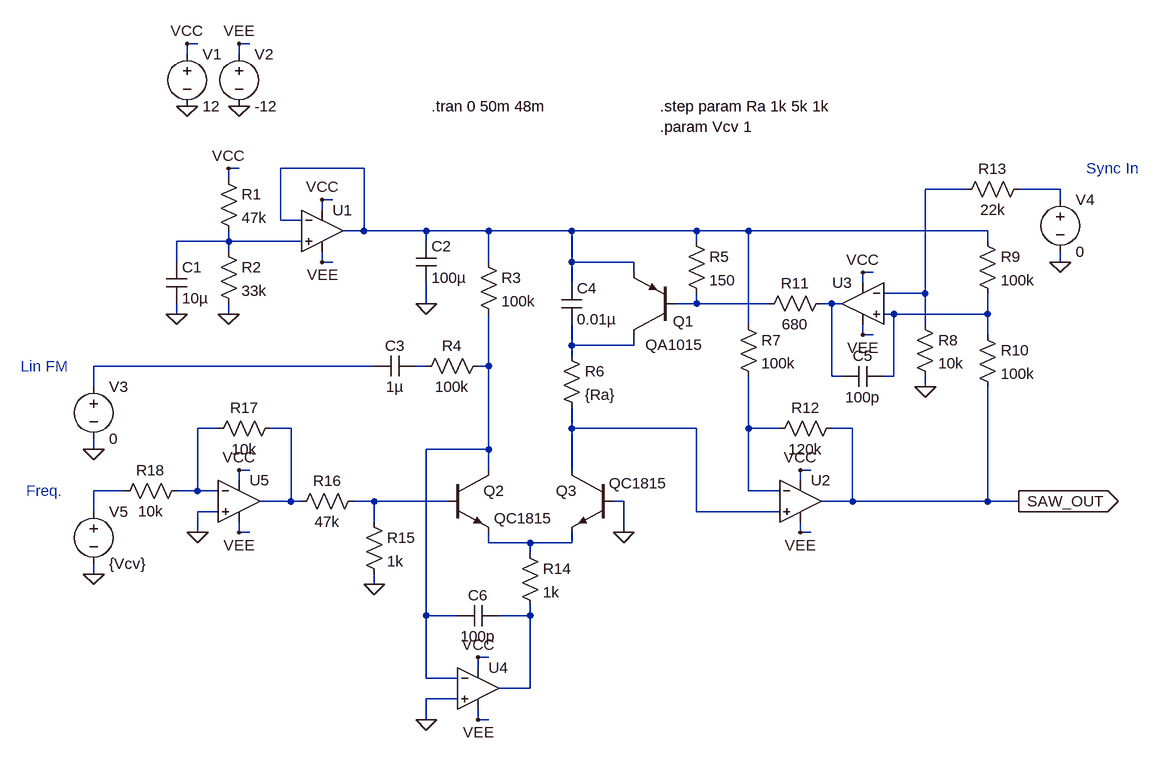
[diagram p0: schematic SawVCO_NPNO_Ra.asc]
SawVCO_NPNO_Ra.asc, the LTspice schematic file:
Version 4
SHEET 1 1492 940
WIRE 32 -144 16 -144
WIRE 112 -144 96 -144
WIRE 16 -128 16 -144
WIRE 96 -128 96 -144
WIRE 96 48 80 48
WIRE 288 48 160 48
WIRE 80 64 80 48
WIRE 1216 80 1152 80
WIRE 1360 80 1296 80
WIRE 240 96 224 96
WIRE 1360 96 1360 80
WIRE 224 112 224 96
WIRE 160 128 160 48
WIRE 192 128 160 128
WIRE 288 144 288 48
WIRE 288 144 256 144
WIRE 384 144 288 144
WIRE 480 144 384 144
WIRE 608 144 480 144
WIRE 800 144 608 144
WIRE 880 144 800 144
WIRE 1248 144 880 144
WIRE 80 160 80 144
WIRE 80 160 0 160
WIRE 192 160 80 160
WIRE 384 160 384 144
WIRE 800 160 800 144
WIRE 1248 160 1248 144
WIRE 80 176 80 160
WIRE 0 192 0 160
WIRE 224 192 224 176
WIRE 240 192 224 192
WIRE 480 192 480 144
WIRE 608 192 608 144
WIRE 704 192 608 192
WIRE 1360 192 1360 176
WIRE 704 208 704 192
WIRE 1072 208 1056 208
WIRE 608 224 608 192
WIRE 1056 224 1056 208
WIRE 1152 240 1152 80
WIRE 1152 240 1088 240
WIRE 384 256 384 224
WIRE 800 256 800 240
WIRE 800 256 768 256
WIRE 912 256 800 256
WIRE 1008 256 992 256
WIRE 1024 256 1008 256
WIRE 0 272 0 256
WIRE 80 272 80 256
WIRE 1104 272 1088 272
WIRE 1248 272 1248 240
WIRE 1248 272 1104 272
WIRE 880 288 880 144
WIRE 1152 288 1152 240
WIRE 1056 304 1056 288
WIRE 1072 304 1056 304
WIRE 1248 304 1248 272
WIRE 608 320 608 288
WIRE 704 320 704 304
WIRE 704 320 608 320
WIRE 608 336 608 320
WIRE 304 352 -128 352
WIRE 384 352 368 352
WIRE 480 352 480 272
WIRE 480 352 464 352
WIRE 1008 368 1008 256
WIRE 1024 368 1008 368
WIRE 1104 368 1104 272
WIRE 1104 368 1088 368
WIRE -128 384 -128 352
WIRE 1152 384 1152 368
WIRE 64 448 32 448
WIRE 176 448 144 448
WIRE 608 448 608 416
WIRE 800 448 608 448
WIRE 880 448 880 368
WIRE 928 448 880 448
WIRE 1040 448 1008 448
WIRE -128 480 -128 464
WIRE 480 480 480 352
WIRE 480 480 384 480
WIRE 112 512 96 512
WIRE 480 512 480 480
WIRE 608 512 608 448
WIRE 976 512 960 512
WIRE 96 528 96 512
WIRE 960 528 960 512
WIRE -80 544 -128 544
WIRE 32 544 32 448
WIRE 32 544 0 544
WIRE 64 544 32 544
WIRE 880 544 880 448
WIRE 928 544 880 544
WIRE 176 560 176 448
WIRE 176 560 128 560
WIRE 192 560 176 560
WIRE 304 560 272 560
WIRE 416 560 304 560
WIRE 688 560 672 560
WIRE 1040 560 1040 448
WIRE 1040 560 992 560
WIRE 1248 560 1248 384
WIRE 1248 560 1040 560
WIRE 1296 560 1248 560
WIRE -128 576 -128 544
WIRE 64 576 32 576
WIRE 800 576 800 448
WIRE 928 576 800 576
WIRE 304 592 304 560
WIRE 32 608 32 576
WIRE 96 608 96 592
WIRE 112 608 96 608
WIRE 688 608 688 560
WIRE 960 608 960 592
WIRE 976 608 960 608
WIRE 480 624 480 608
WIRE 544 624 480 624
WIRE 608 624 608 608
WIRE 608 624 544 624
WIRE 544 640 544 624
WIRE -128 672 -128 656
WIRE 304 688 304 672
WIRE 384 736 384 480
WIRE 432 736 384 736
WIRE 544 736 544 720
WIRE 544 736 496 736
WIRE 480 800 464 800
WIRE 464 816 464 800
WIRE 384 832 384 736
WIRE 432 832 384 832
WIRE 544 848 544 736
WIRE 544 848 496 848
WIRE 432 864 384 864
WIRE 384 896 384 864
WIRE 464 896 464 880
WIRE 480 896 464 896
FLAG 80 48 VCC
FLAG 224 96 VCC
FLAG 224 192 VEE
FLAG 16 -48 0
FLAG 96 -48 0
FLAG 16 -144 VCC
FLAG 96 -144 VEE
FLAG 80 272 0
FLAG 0 272 0
FLAG 384 256 0
FLAG -128 480 0
FLAG 1056 208 VCC
FLAG 1056 304 VEE
FLAG 1152 384 0
FLAG 960 512 VCC
FLAG 960 608 VEE
FLAG 1360 192 0
FLAG 1296 560 SAW_OUT
IOPIN 1296 560 Out
FLAG 688 608 0
FLAG 464 800 VCC
FLAG 464 896 VEE
FLAG 384 896 0
FLAG 304 688 0
FLAG 96 512 VCC
FLAG 96 608 VEE
FLAG 32 608 0
FLAG -128 672 0
SYMBOL res 64 48 R0
SYMATTR InstName R1
SYMATTR Value 47k
SYMBOL res 64 160 R0
SYMATTR InstName R2
SYMATTR Value 33k
SYMBOL voltage 16 -144 R0
WINDOW 123 0 0 Left 0
WINDOW 39 0 0 Left 0
SYMATTR InstName V1
SYMATTR Value 12
SYMBOL voltage 96 -144 R0
WINDOW 123 0 0 Left 0
WINDOW 39 0 0 Left 0
SYMATTR InstName V2
SYMATTR Value -12
SYMBOL cap -16 192 R0
SYMATTR InstName C1
SYMATTR Value 10µ
SYMBOL cap 368 160 R0
SYMATTR InstName C2
SYMATTR Value 100µ
SYMBOL res 464 176 R0
SYMATTR InstName R3
SYMATTR Value 100k
SYMBOL res 480 336 R90
WINDOW 0 0 56 VBottom 2
WINDOW 3 32 56 VTop 2
SYMATTR InstName R4
SYMATTR Value 100k
SYMBOL cap 368 336 R90
WINDOW 0 0 32 VBottom 2
WINDOW 3 32 32 VTop 2
SYMATTR InstName C3
SYMATTR Value 1µ
SYMBOL voltage -128 368 R0
WINDOW 123 0 0 Left 0
WINDOW 39 0 0 Left 0
SYMATTR InstName V3
SYMATTR Value 0
SYMBOL cap 592 224 R0
SYMATTR InstName C4
SYMATTR Value 0.01µ
SYMBOL pnp 768 304 R180
WINDOW 0 -28 21 Left 2
WINDOW 3 -42 -15 Left 2
SYMATTR InstName Q1
SYMATTR Value QA1015
SYMBOL res 784 144 R0
SYMATTR InstName R5
SYMATTR Value 150
SYMBOL res 592 320 R0
SYMATTR InstName R6
SYMATTR Value {Ra}
SYMBOL res 864 272 R0
SYMATTR InstName R7
SYMATTR Value 100k
SYMBOL cap 1088 352 R90
WINDOW 0 0 32 VBottom 2
WINDOW 3 32 32 VTop 2
SYMATTR InstName C5
SYMATTR Value 100p
SYMBOL res 1136 272 R0
SYMATTR InstName R8
SYMATTR Value 10k
SYMBOL res 1232 144 R0
SYMATTR InstName R9
SYMATTR Value 100k
SYMBOL res 1232 288 R0
SYMATTR InstName R10
SYMATTR Value 100k
SYMBOL res 1008 240 R90
WINDOW 0 0 56 VBottom 2
WINDOW 3 32 56 VTop 2
SYMATTR InstName R11
SYMATTR Value 680
SYMBOL res 1024 432 R90
WINDOW 0 0 56 VBottom 2
WINDOW 3 32 56 VTop 2
SYMATTR InstName R12
SYMATTR Value 120k
SYMBOL res 1312 64 R90
WINDOW 0 0 56 VBottom 2
WINDOW 3 32 56 VTop 2
SYMATTR InstName R13
SYMATTR Value 22k
SYMBOL voltage 1360 80 R0
WINDOW 123 0 0 Left 0
WINDOW 39 0 0 Left 0
SYMATTR InstName V4
SYMATTR Value 0
SYMBOL Opamps\\UniversalOpamp2 224 144 R0
SYMATTR InstName U1
SYMBOL Opamps\\UniversalOpamp2 960 560 R0
SYMATTR InstName U2
SYMBOL Opamps\\UniversalOpamp2 1056 256 M0
SYMATTR InstName U3
SYMBOL npn 416 512 R0
WINDOW 3 72 74 Left 2
SYMATTR Value QC1815
SYMATTR InstName Q2
SYMBOL npn 672 512 M0
WINDOW 3 -83 20 Left 2
SYMATTR Value QC1815
SYMATTR InstName Q3
SYMBOL res 528 624 R0
SYMATTR InstName R14
SYMATTR Value 1k
SYMBOL Opamps\\UniversalOpamp2 464 848 R0
SYMATTR InstName U4
SYMBOL cap 496 720 R90
WINDOW 0 0 32 VBottom 2
WINDOW 3 32 32 VTop 2
SYMATTR InstName C6
SYMATTR Value 100p
SYMBOL res 288 576 R0
SYMATTR InstName R15
SYMATTR Value 1k
SYMBOL res 288 544 R90
WINDOW 0 0 56 VBottom 2
WINDOW 3 32 56 VTop 2
SYMATTR InstName R16
SYMATTR Value 47k
SYMBOL Opamps\\UniversalOpamp2 96 560 R0
SYMATTR InstName U5
SYMBOL res 160 432 R90
WINDOW 0 0 56 VBottom 2
WINDOW 3 32 56 VTop 2
SYMATTR InstName R17
SYMATTR Value 10k
SYMBOL res 16 528 R90
WINDOW 0 0 56 VBottom 2
WINDOW 3 32 56 VTop 2
SYMATTR InstName R18
SYMATTR Value 10k
SYMBOL voltage -128 560 R0
WINDOW 123 0 0 Left 0
WINDOW 39 0 0 Left 0
SYMATTR InstName V5
SYMATTR Value {Vcv}
TEXT 392 -48 Left 2 !.tran 0 50m 48m
TEXT 744 -48 Left 2 !.step param Ra 1k 5k 1k
TEXT 744 -16 Left 2 !.param Vcv 1
TEXT -232 544 Left 2 ;Freq.
TEXT -240 352 Left 2 ;Lin FM
TEXT 1400 48 Left 2 ;Sync In

The netlist it stands for:
* SawVCO_NPNO_Ra.asc
R1 VCC N004 47k
R2 N004 0 33k
V1 VCC 0 12
V2 VEE 0 -12
C1 N004 0 10µ
C2 N001 0 100µ
R3 N001 N011 100k
R4 N011 N010 100k
C3 N010 N009 1µ
V3 N009 0 0
C4 N001 N008 0.01µ
Q1 N008 N005 N001 0 QA1015
R5 N001 N005 150
R6 N008 N014 {Ra}
R7 N001 N015 100k
C5 N007 N006 100p
R8 N002 0 10k
R9 N001 N007 100k
R10 N007 SAW_OUT 100k
R11 N006 N005 680
R12 SAW_OUT N015 120k
R13 N003 N002 22k
V4 N003 0 0
XU1 N004 N001 VCC VEE N001 level.2 Avol=1Meg GBW=10Meg Slew=10Meg ilimit=25m rail=0 Vos=0 phimargin=45 en=0 enk=0 in=0 ink=0 Rin=500Meg  ; pins IN+ IN- V+ V- OUT
XU2 N014 N015 VCC VEE SAW_OUT level.2 Avol=1Meg GBW=10Meg Slew=10Meg ilimit=25m rail=0 Vos=0 phimargin=45 en=0 enk=0 in=0 ink=0 Rin=500Meg  ; pins IN+ IN- V+ V- OUT
XU3 N007 N002 VCC VEE N006 level.2 Avol=1Meg GBW=10Meg Slew=10Meg ilimit=25m rail=0 Vos=0 phimargin=45 en=0 enk=0 in=0 ink=0 Rin=500Meg  ; pins IN+ IN- V+ V- OUT
Q2 N011 N017 N018 0 QC1815
Q3 N014 0 N018 0 QC1815
R14 N018 N019 1k
XU4 0 N011 VCC VEE N019 level.2 Avol=1Meg GBW=10Meg Slew=10Meg ilimit=25m rail=0 Vos=0 phimargin=45 en=0 enk=0 in=0 ink=0 Rin=500Meg  ; pins IN+ IN- V+ V- OUT
C6 N019 N011 100p
R15 N017 0 1k
R16 N017 N013 47k
XU5 0 N012 VCC VEE N013 level.2 Avol=1Meg GBW=10Meg Slew=10Meg ilimit=25m rail=0 Vos=0 phimargin=45 en=0 enk=0 in=0 ink=0 Rin=500Meg  ; pins IN+ IN- V+ V- OUT
R17 N013 N012 10k
R18 N012 N016 10k
V5 N016 0 {Vcv}
.model NPN NPN
.model PNP PNP
.lib standard.bjt
.tran 0 50m 48m
.step param Ra 1k 5k 1k
.param Vcv 1
* Freq.
* Lin FM
* Sync In
.lib UniversalOpamps2.sub
.backanno
.end